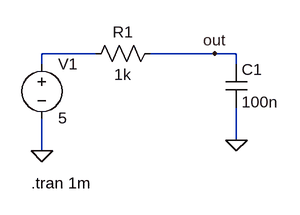
[diagram p0: schematic older_version.asc]
older_version.asc, the LTspice schematic file:
Version 4
SHEET 1 880 680
WIRE 208 128 112 128
WIRE 240 128 208 128
WIRE 32 128 -48 128
WIRE -48 144 -48 128
WIRE 240 144 240 128
WIRE 240 256 240 208
WIRE -48 272 -48 224
FLAG 240 256 0
FLAG -48 272 0
FLAG 208 128 out
SYMBOL voltage -48 128 R0
SYMATTR InstName V1
SYMATTR Value 5
SYMBOL res 128 112 R90
WINDOW 0 0 56 VBottom 2
WINDOW 3 32 56 VTop 2
SYMATTR InstName R1
SYMATTR Value 1k
SYMBOL cap 224 144 R0
SYMATTR InstName C1
SYMATTR Value 100n
TEXT -64 320 Left 2 !.tran 1m

The netlist it stands for:
* older_version.asc
V1 N001 0 5
R1 out N001 1k
C1 out 0 100n
.tran 1m
.backanno
.end